# EAGLE schematic usupply (EAGLE 7.6.0)
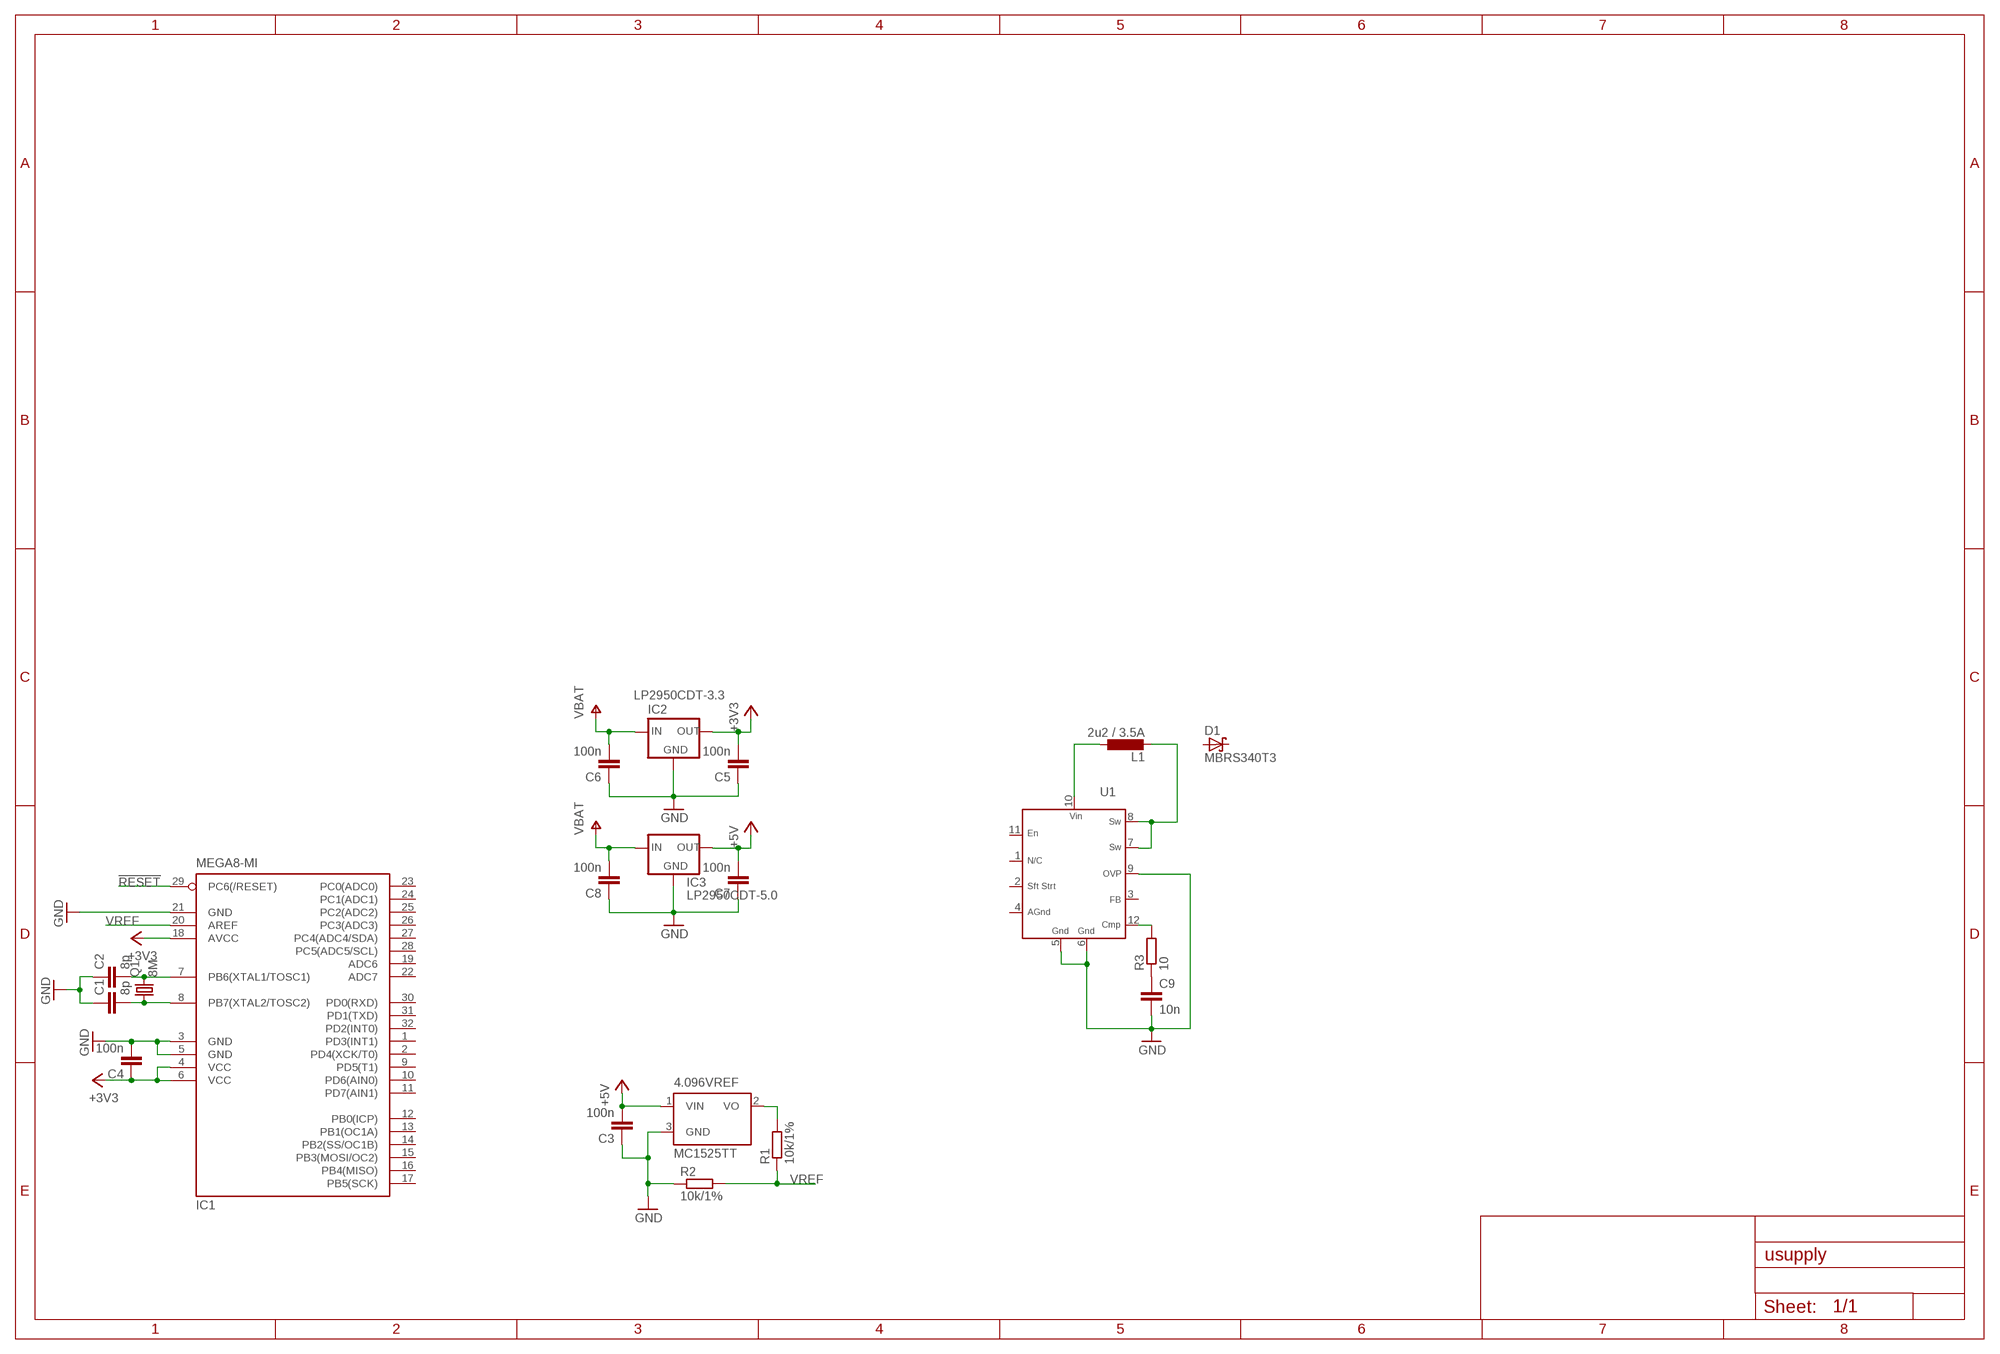
[diagram p0: schematic, sheet 1]

## Parts
4.096VREF  MC1525TT  [SOT23]
C1  8p  C-EUC0805  [C0805]
C2  8p  C-EUC0805  [C0805]
C3  100n  C-EUC0805  [C0805]
C4  100n  C-EUC0805  [C0805]
C5  100n  C-EUC0805  [C0805]
C6  100n  C-EUC0805  [C0805]
C7  100n  C-EUC0805  [C0805]
C8  100n  C-EUC0805  [C0805]
C9  10n  C-EUC0805  [C0805]
D1  MBRS340T3  [SMC]
IC1  MEGA8-MI  [MLF32]
IC2  LP2950CDT-3.3  [DPACK]
IC3  LP2950CDT-5.0  [DPACK]
L1  2u2 / 3.5A  L-EUPIS2816  [PIS2816]
Q1  8M  CRYSTALHC49U-V  [HC49U-V]
R1  10k/1%  R-EU_M0805  [M0805]
R2  10k/1%  R-EU_M0805  [M0805]
R3  10  R-EU_M0805  [M0805]
U1  MIC2253  [MLF12_3.0MM_X_3.0MM]

## Nets
!RESET: IC1.29(PC6(/RESET))
+3V3: C4.1 C5.2 IC1.4(VCC) IC1.6(VCC) IC1.18(AVCC) IC2.3(OUT)
+5V: 4.096VREF.1(VIN) C3.2 C7.2 IC3.3(OUT)
GND: 4.096VREF.3(GND) C1.1 C2.1 C3.1 C4.2 C5.1 C6.1 C7.1 C8.1 C9.2 IC1.3(GND) IC1.5(GND) IC1.21(GND) IC2.4(GND) IC3.4(GND) R2.1 U1.5(GND) U1.6(GND) U1.9(OVP)
N$1: C1.2 IC1.8(PB7(XTAL2/TOSC2)) Q1.1
N$2: C2.2 IC1.7(PB6(XTAL1/TOSC1)) Q1.2
N$5: R3.2 U1.12(CMP)
N$6: C9.1 R3.1
N$7: 4.096VREF.2(VO) R1.2
N$8: L1.2 U1.7(SW) U1.8(SW)
N$9: L1.1 U1.10(VIN)
V+: C6.2 C8.2 IC2.1(IN) IC3.1(IN) ; supply symbol labelled VBAT
VREF: IC1.20(AREF) R1.1 R2.2
Unconnected: D1.A D1.C IC1.1(PD3(INT1)) IC1.2(PD4(XCK/T0)) IC1.9(PD5(T1)) IC1.10(PD6(AIN0)) IC1.11(PD7(AIN1)) IC1.12(PB0(ICP)) IC1.13(PB1(OC1A)) IC1.14(PB2(SS/OC1B)) IC1.15(PB3(MOSI/OC2)) IC1.16(PB4(MISO)) IC1.17(PB5(SCK)) IC1.19(ADC6) IC1.22(ADC7) IC1.23(PC0(ADC0)) IC1.24(PC1(ADC1)) IC1.25(PC2(ADC2)) IC1.26(PC3(ADC3)) IC1.27(PC4(ADC4/SDA)) IC1.28(PC5(ADC5/SCL)) IC1.30(PD0(RXD)) IC1.31(PD1(TXD)) IC1.32(PD2(INT0)) U1.1(NC) U1.2(SS) U1.3(FB) U1.4(AGND) U1.11(EN)

## Library data of the parts
4.096VREF = microchip:MC15*: 2.5V and 4.096V Voltage References Source: http://www.microchip.com .. 21653b.pdf; OC_FARNELL: unknown; OC_NEWARK: unknown
C1-C9 = rcl:C-EU: CAPACITOR, European symbol
D1 = diode:MBRS3*0T3: SCHOTTKY BARRIER RECTIFIER 3.0 AMPERES 20, 30, 40 VOLT Source: MBRS340T3-D.pdf
IC1 = atmel:MEGA8: MICROCONTROLLER 8 Kbytes FLASH, 1 kbytes SRAM, 512 bytes EEPROM, USART, 6-channel 10 bit ADC, 2-channel 8 bit ADC Pin compatible with Atmega48, ATMega88, ATMega168 Source: avr.lbr; MPN: ATMEGA88PA-MU; OC_FARNELL: 1715491; OC_NEWARK: 15R0272
IC2 IC3 = v-reg:LP2950?*: Source: http://cache.national.com/ds/LP/LP2950.pdf
L1 = rcl:L-EU: INDUCTOR, European symbol
Q1 = crystal:CRYSTAL: CRYSTAL; OC_FARNELL: 1666969; OC_NEWARK: unknown
R1-R3 = rcl:R-EU_: RESISTOR, European symbol
U1 = MIC2253_MLF12:MIC2253: MIC2253 - 3.5A, 1 MHz High Efficiency, Variable Voltage Inuput Boost Regulator with Over Voltage Protection and Soft-Start, Micrel 02-13-2013 - troneeee@gmail.com